# Altium schematic sheet HVManagerLevel.SchDoc
size A
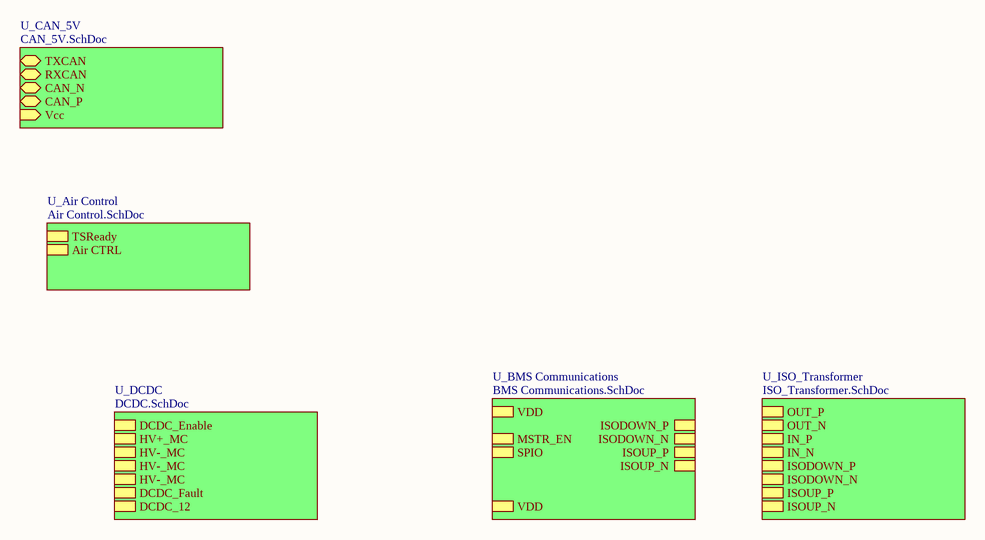
[diagram p0: HVManagerLevel.SchDoc]

## Sub-sheets
U_Air Control = Air Control.SchDoc: TSReady, Air CTRL
U_BMS Communications = BMS Communications.SchDoc: ISODOWN_P, ISODOWN_N, VDD, MSTR_EN, SPIO (harness *), ISOUP_P, ISOUP_N, VDD
U_CAN_5V = CAN_5V.SchDoc: TXCAN (bidir), RXCAN (bidir), CAN_N (bidir), CAN_P (bidir), Vcc (in)
U_DCDC = DCDC.SchDoc: DCDC_Enable, HV+_MC, HV-_MC, HV-_MC, HV-_MC, DCDC_Fault, DCDC_12
U_ISO_Transformer = ISO_Transformer.SchDoc: OUT_P, OUT_N, IN_P, IN_N, ISODOWN_P, ISODOWN_N, ISOUP_P, ISOUP_N